# EAGLE design picjtag (EAGLE 6.1)
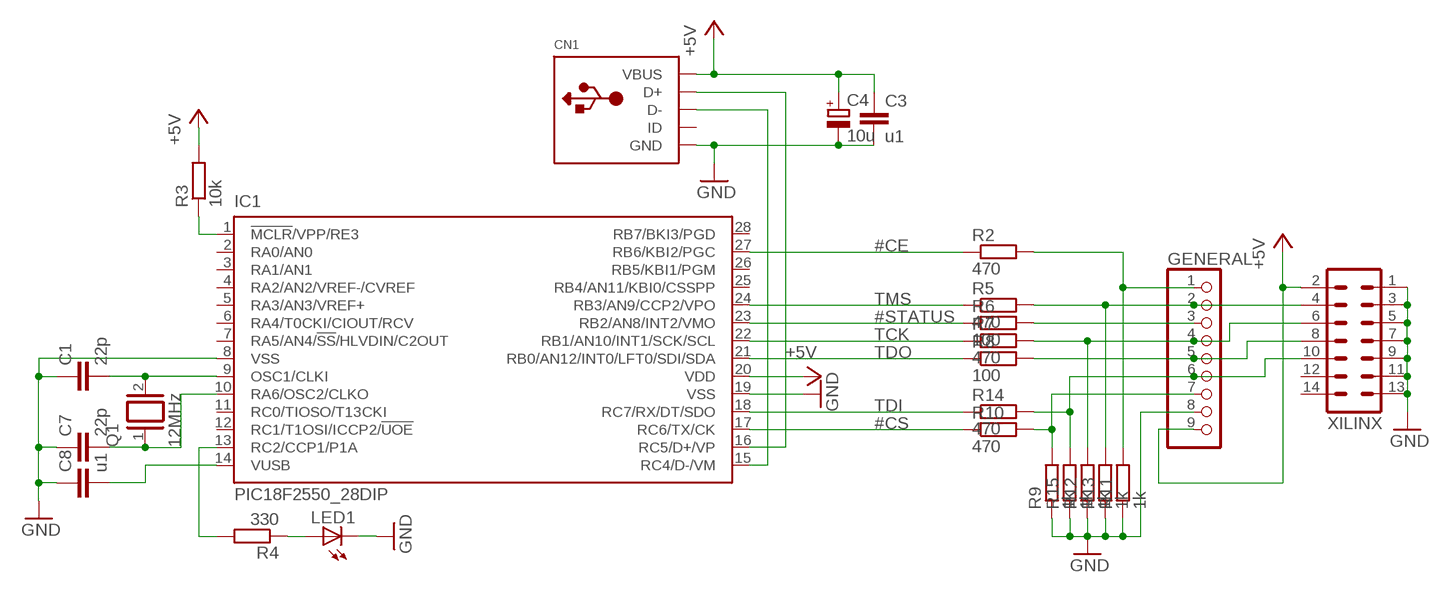
[diagram p0: schematic, sheet 1]

## Parts
C1  22p  C-EU025-025X050  [C025-025X050]
C3  u1  C-EU025-025X050  [C025-025X050]
C4  10u  CPOL-EUE2,5-6E  [E2,5-6E]
C7  22p  C-EU025-025X050  [C025-025X050]
C8  u1  C-EU025-025X050  [C025-025X050]
CN1  USBTHM  [USB-MINIB-THM]
GENERAL  PINHD-1X9  [1X09]
IC1  PIC18F2550_28DIP  [DIL28-3]
LED1  LED3MM  [LED3MM]
Q1  12MHz  XTAL/S  [QS]
R2  470  R-EU_0207/2V  [0207/2V]
R3  10k  R-EU_0207/2V  [0207/2V]
R4  330  R-EU_0207/2V  [0207/2V]
R5  470  R-EU_0207/2V  [0207/2V]
R6  100  R-EU_0207/2V  [0207/2V]
R7  470  R-EU_0207/2V  [0207/2V]
R8  100  R-EU_0207/2V  [0207/2V]
R9  1k  R-EU_0207/2V  [0207/2V]
R10  470  R-EU_0207/2V  [0207/2V]
R11  1k  R-EU_0207/2V  [0207/2V]
R12  1k  R-EU_0207/2V  [0207/2V]
R13  1k  R-EU_0207/2V  [0207/2V]
R14  470  R-EU_0207/2V  [0207/2V]
R15  1k  R-EU_0207/2V  [0207/2V]
XILINX  ML14  [ML14]

## Nets
#CE: IC1.27(RB6/KBI2/PGC) R2.1
#CS: IC1.17(RC6/TX/CK) R10.1
#STATUS: IC1.23(RB2/AN8/INT2/VMO) R6.1
+5V: C3.1 C4.+ CN1.VBUS GENERAL.9 IC1.20(VDD) R3.2 XILINX.2
GND: C1.1 C3.2 C4.- C7.1 C8.1 CN1.GND GENERAL.8 IC1.8(VSS) IC1.19(VSS) LED1.K(C) R9.1 R11.1 R12.1 R13.1 R15.1 XILINX.1 XILINX.3 XILINX.5 XILINX.7 XILINX.9 XILINX.11 XILINX.13
N$1: C7.2 IC1.10(RA6/OSC2/CLKO) Q1.1
N$2: IC1.1(!MCLR!/VPP/RE3) R3.1
N$3: CN1.D- IC1.15(RC4/D-/VM)
N$4: CN1.D+ IC1.16(RC5/D+/VP)
N$5: IC1.13(RC2/CCP1/P1A) R4.2
N$6: LED1.A R4.1
N$7: C1.2 IC1.9(OSC1/CLKI) Q1.2
N$8: C8.2 IC1.14(VUSB)
N$9: GENERAL.7 R9.2 R10.2
N$10: GENERAL.6 R14.2 R15.2 XILINX.10
N$11: GENERAL.4 R7.2 R12.2 XILINX.6
N$12: GENERAL.2 R5.2 R13.2 XILINX.4
N$13: GENERAL.1 R2.2 R11.2
N$14: GENERAL.5 R8.2 XILINX.8
N$15: GENERAL.3 R6.2
TCK: IC1.22(RB1/AN10/INT1/SCK/SCL) R7.1
TDI: IC1.18(RC7/RX/DT/SDO) R14.1
TDO: IC1.21(RB0/AN12/INT0/LFT0/SDI/SDA) R8.1
TMS: IC1.24(RB3/AN9/CCP2/VPO) R5.1
Unconnected: CN1.ID IC1.2(RA0/AN0) IC1.3(RA1/AN1) IC1.4(RA2/AN2/VREF-/CVREF) IC1.5(RA3/AN3/VREF+) IC1.6(RA4/T0CKI/CIOUT/RCV) IC1.7(RA5/AN4/!SS!/HLVDIN/C2OUT) IC1.11(RC0/TIOSO/T13CKI) IC1.12(RC1/T1OSI/ICCP2/!UOE) IC1.25(RB4/AN11/KBI0/CSSPP) IC1.26(RB5/KBI1/PGM) IC1.28(RB7/BKI3/PGD) XILINX.12 XILINX.14

## Library data of the parts
C1 C3 C7 C8 = rcl:C-EU: CAPACITOR, European symbol
C4 = rcl:CPOL-EU: POLARIZED CAPACITOR, European symbol
CN1 = adafruit:USB: USB Connectors USBMINIB - Surface Mount Female Mini-B USB Connector 4UConnector: 06564 By microbuilder.eu Thru-hole RA Female Mini-B USB Connector 4UConnector: 18732 By ladyada.net
GENERAL = pinhead:PINHD-1X9: PIN HEADER
IC1 = microchip:PIC18F2*_28: USB Microcontrollers with nanoWatt Technology High-Performance, Enhanced Flash, 28/40/44-Pin, Source: http://ww1.microchip.com/downloads/en/devicedoc/39632c.pdf; MF: MICROCHIP; MPN: PIC18F2550-I/SP; OC_FARNELL: 1523822; OC_NEWARK: 80K6054
LED1 = led:LED: LED OSRAM: - CHIPLED LG R971, LG N971, LY N971, LG Q971, LY Q971, LO R971, LY R971 LH N974, LH R974 LS Q976, LO Q976, LY Q976 LO Q996 - Hyper CHIPLED LW Q18S LB Q993, LB Q99A, LB R99A - SideLED LS A670, LO A670, LY A670, LG A670, LP A670 LB A673, LV A673, LT A673, LW A673 LH A674 LY A675 LS A676, LA A676, LO A676, LY A676, LW A676 LS A679, LY A679, LG A679 - Hyper Micro SIDELED® LS Y876, LA Y876, LO Y876, LY Y876 LT Y87S - SmartLED LW L88C, LW L88S LB L89C, LB L89S, LG L890 LS L89K, LO L89K, LY L89K LS L896, LA L896, LO L896, LY L896 - TOPLED LS T670, LO T670, LY T670, LG T670, LP T670 LSG T670, LSP T670, LSY T670, LOP T670, LYG T670 LG T671, LOG T671, LSG T671 LB T673, LV T673, LT T673, LW T673 LH T674 LS T676, LA T676, LO T676, LY T676, LB T676, LH T676, LSB T676, LW T676 LB T67C, LV T67C, LT T67C, LS T67K, LO T67K, LY T67K, LW E67C LS E67B, LA E67B, LO E67B, LY E67B, LB E67C, LV E67C, LT E67C LW T67C LS T679, LY T679, LG T679 LS T770, LO T770, LY T770, LG T770, LP T770 LB T773, LV T773, LT T773, LW T773 LH T774 LS E675, LA E675, LY E675, LS T675 LS T776, LA T776, LO T776, LY T776, LB T776 LHGB T686 LT T68C, LB T68C - Hyper Mini TOPLED® LB M676 - Mini TOPLED Santana® LG M470 LS M47K, LO M47K, LY M47K Source: http://www.osram.convergy.de LUXEON: - LUMILED® LXK2-PW12-R00, LXK2-PW12-S00, LXK2-PW14-U00, LXK2-PW14-V00 LXK2-PM12-R00, LXK2-PM12-S00, LXK2-PM14-U00 LXK2-PE12-Q00, LXK2-PE12-R00, LXK2-PE12-S00, LXK2-PE14-T00, LXK2-PE14-U00 LXK2-PB12-K00, LXK2-PB12-L00, LXK2-PB12-M00, LXK2-PB14-N00, LXK2-PB14-P00, LXK2-PB14-Q00 LXK2-PR12-L00, LXK2-PR12-M00, LXK2-PR14-Q00, LXK2-PR14-R00 LXK2-PD12-Q00, LXK2-PD12-R00, LXK2-PD12-S00 LXK2-PH12-R00, LXK2-PH12-S00 LXK2-PL12-P00, LXK2-PL12-Q00, LXK2-PL12-R00 Source: www.luxeon.com KINGBRIGHT: KA-3528ASYC Source: www.kingbright.com
Q1 = special:XTAL/S: CRYSTAL
R2-R15 = rcl:R-EU_: RESISTOR, European symbol
XILINX = con-harting-ml:ML14: HARTING; OC_FARNELL: unknown; OC_NEWARK: unknown

## Board
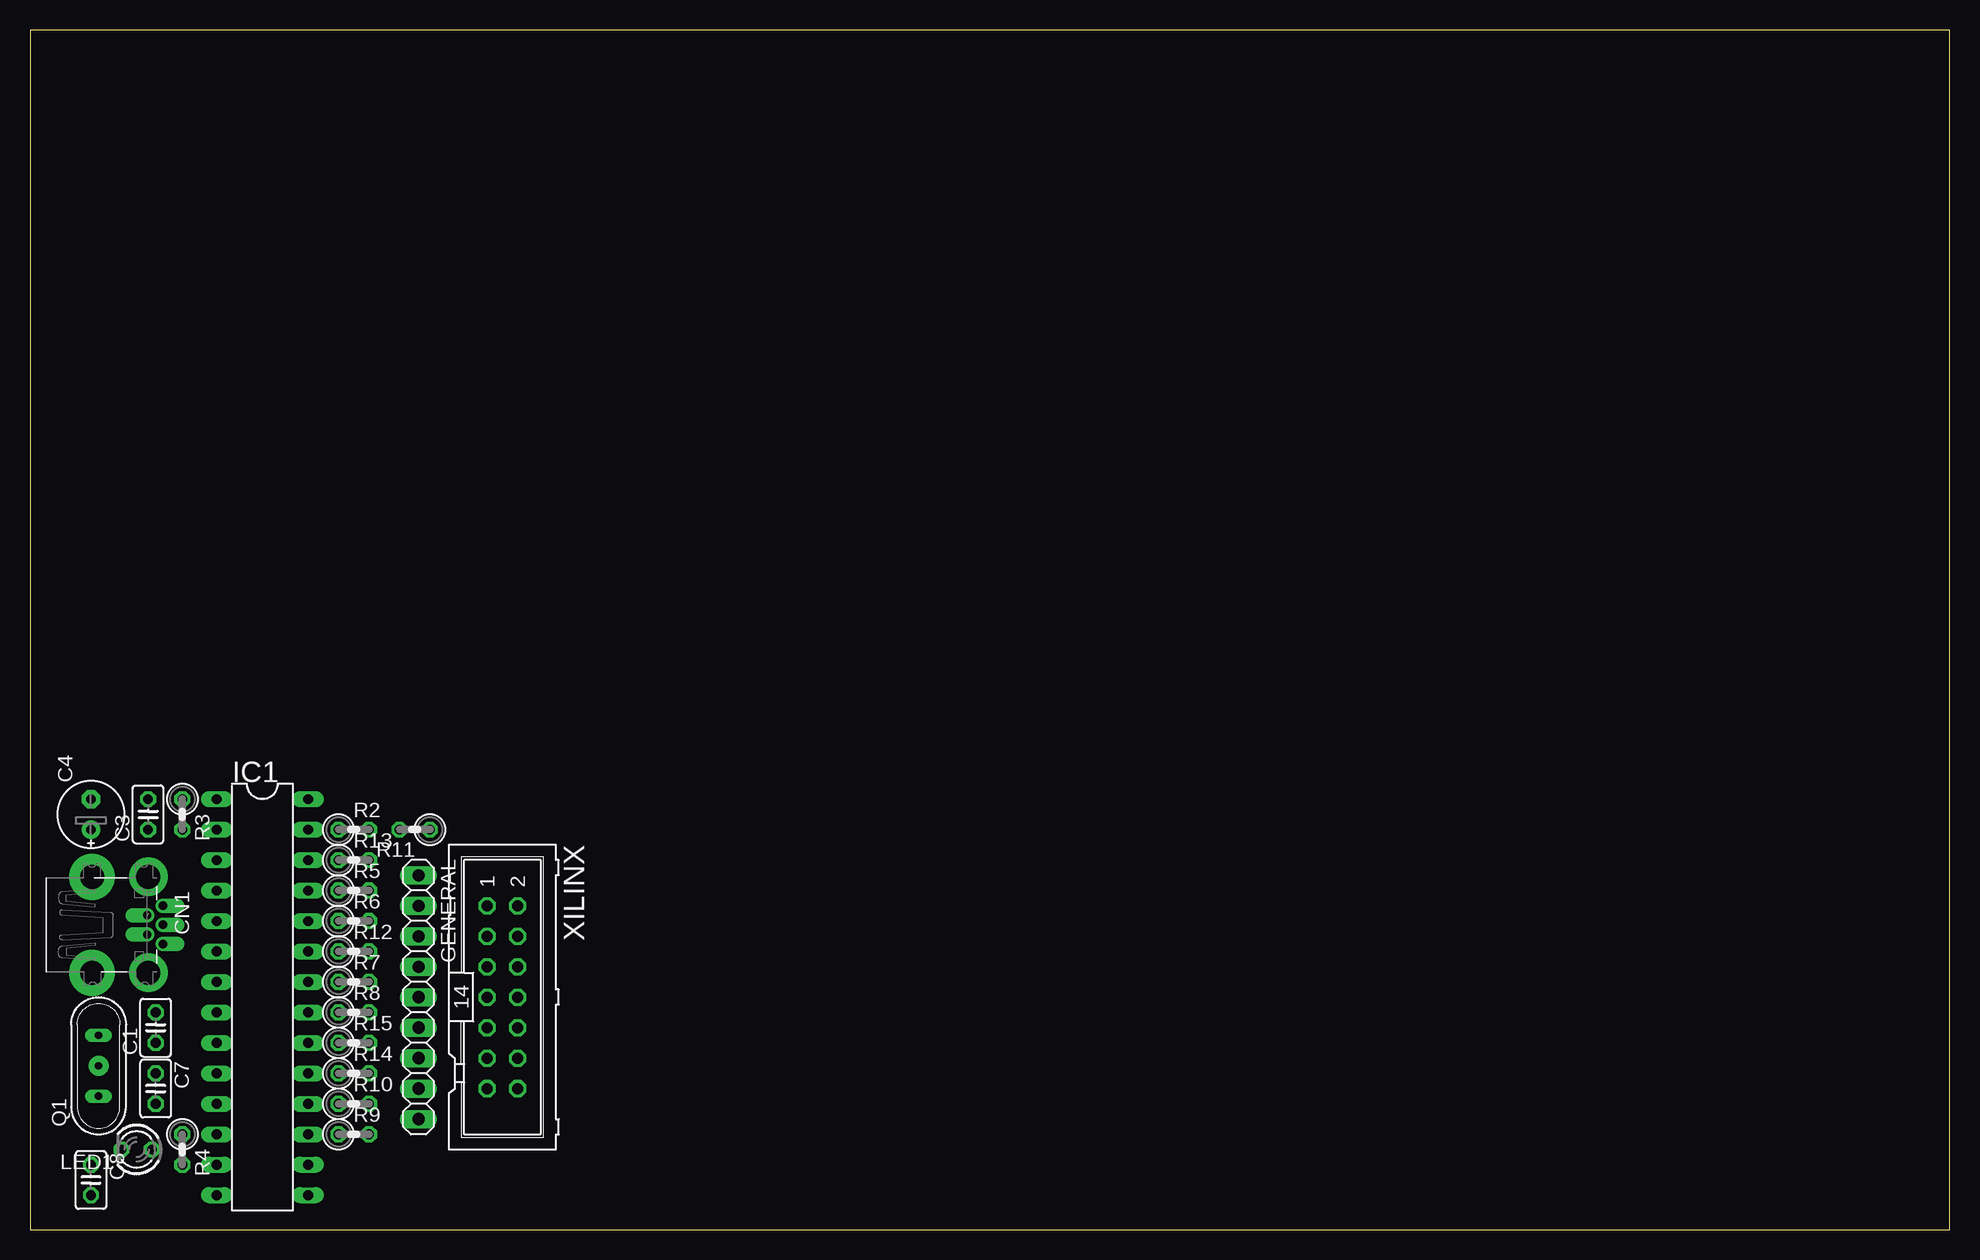
[diagram p1: board, top side]
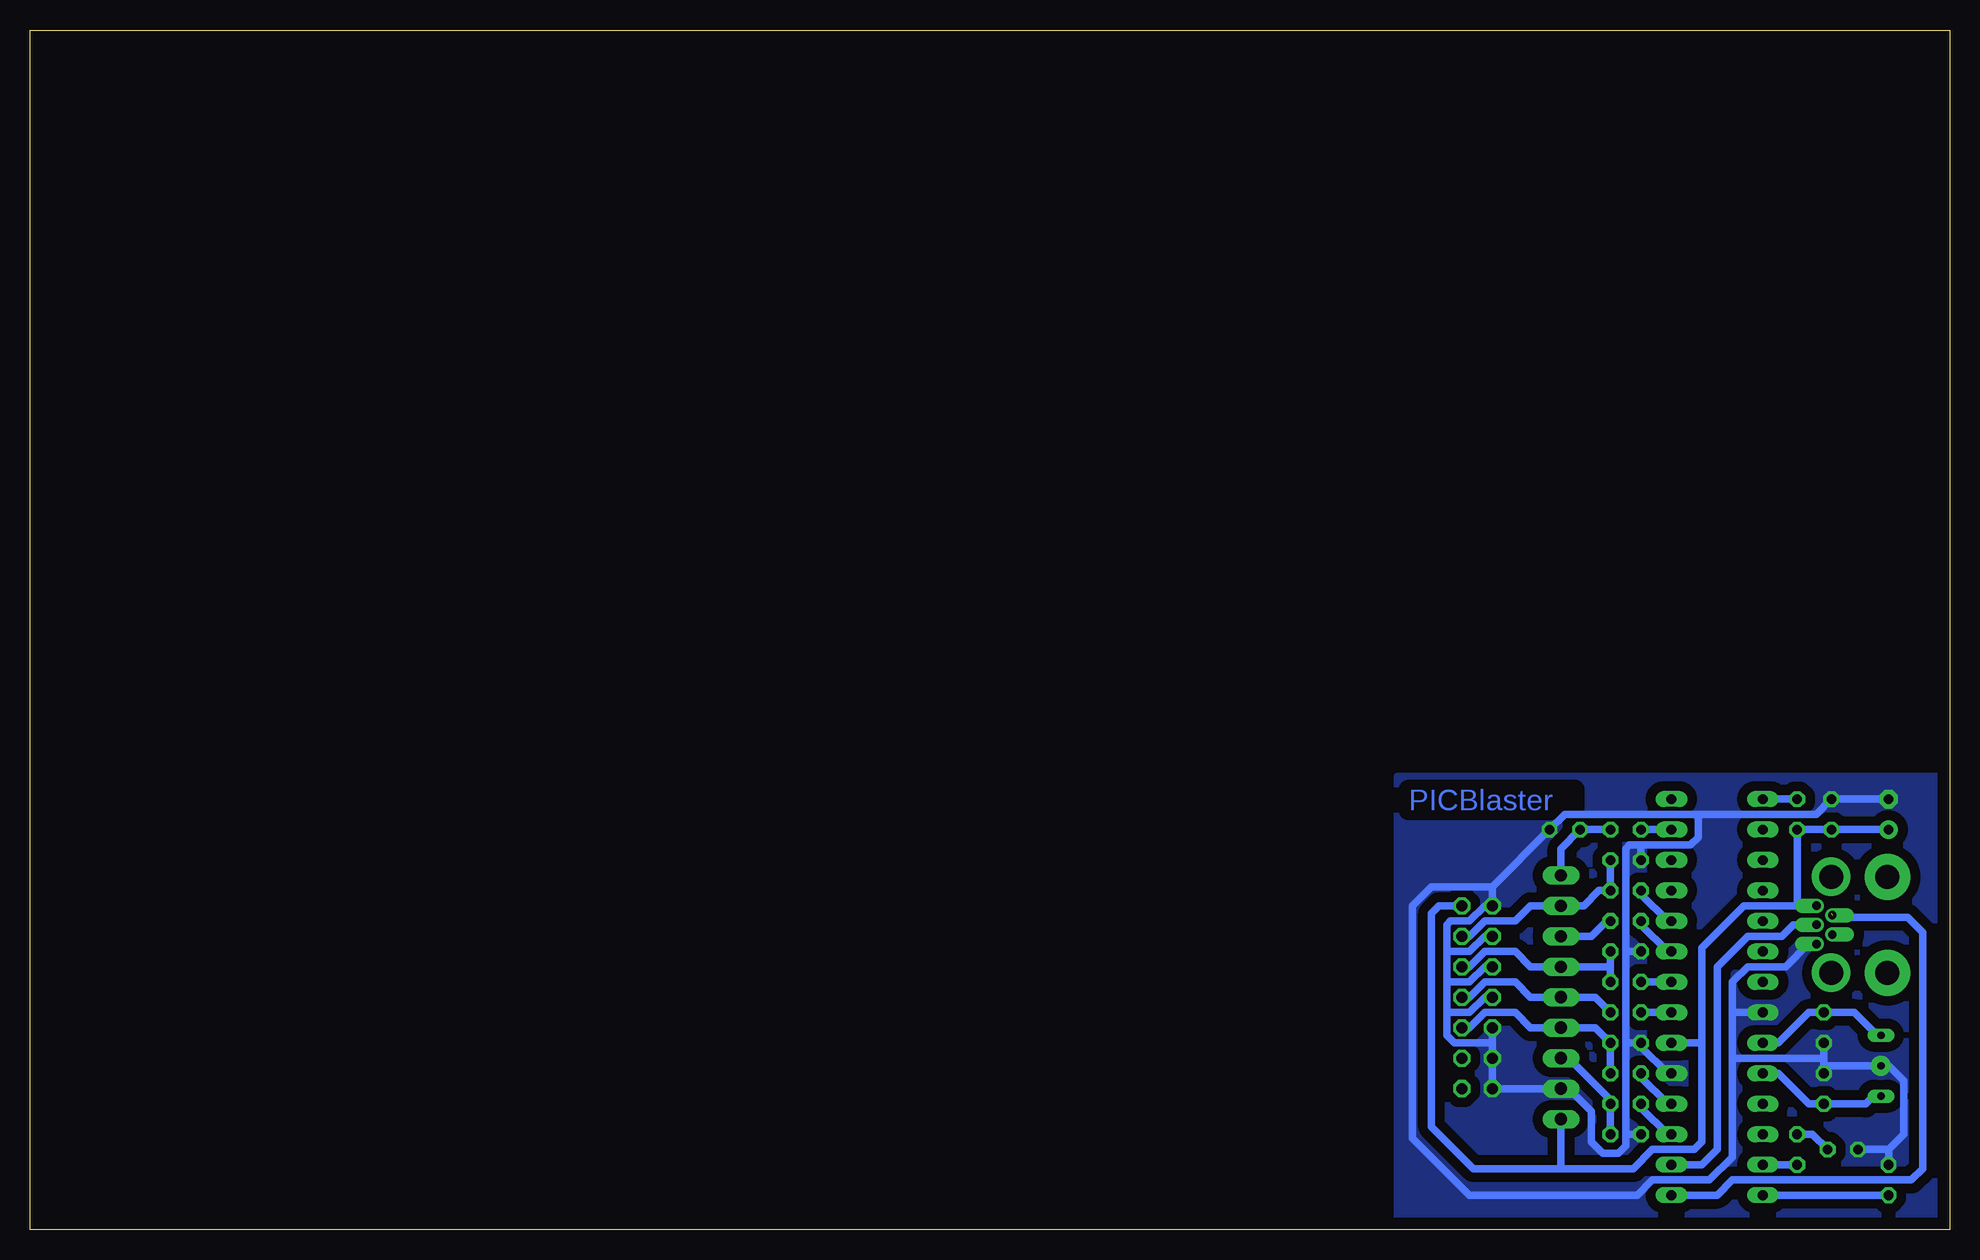
[diagram p2: board, bottom side, seen from below]

Size 160 x 100 mm. Coordinates in mm from the lower left corner, seen from the top.
Outline: 0,0 160,0 160,100 0,100 0,0
Copper layers (1*16): Top 0.035mm / dielectric 1.5mm / Bottom 0.035mm
Design rules: minimum track width 10mil, minimum drill 24mil, track to track 8mil, track to pad 8mil, pad to pad 8mil, via to via 8mil, smd to smd 8mil, copper to edge 40mil, drill to drill 8mil, minimum pad ring 10mil, minimum via ring 8mil, stop-mask expansion 4mil, vias tented up to drill 0mil, thermal gap 10mil

### Footprints (pad centres in the part's own frame; a part is rotated, then mirrored left to right if it is on the bottom)
C025-025X050 = drill 0.813 octagon: 1 -1.27,0; 2 1.27,0
E2,5-6E = drill 0.813 pad 1.575: + -1.27,0 | drill 0.813 pad 1.575 octagon: - 1.27,0
USB-MINIB-THM = drill 0.7 offset: D+ 0,9.8; D- -0.8,8.5; GND 1.6,9.8; ID 0.8,8.5; VBUS -1.6,9.8 | drill 2 pad 3.81: GND1 -4,3.9; GND4 4,3.9 | drill 2 pad 3.2: GND2 -4,8.6; GND3 4,8.6
1X09 = drill 1.016 long: 1 -10.16,0; 2 -7.62,0; 3 -5.08,0; 4 -2.54,0; 5 0,0; 6 2.54,0; 7 5.08,0; 8 7.62,0; 9 10.16,0
DIL28-3 = drill 0.813 long: 1 -16.51,-3.81; 2 -13.97,-3.81; 3 -11.43,-3.81; 4 -8.89,-3.81; 5 -6.35,-3.81; 6 -3.81,-3.81; 7 -1.27,-3.81; 8 1.27,-3.81; 9 3.81,-3.81; 10 6.35,-3.81; 11 8.89,-3.81; 12 11.43,-3.81; 13 13.97,-3.81; 14 16.51,-3.81; 15 16.51,3.81; 16 13.97,3.81; 17 11.43,3.81; 18 8.89,3.81; 19 6.35,3.81; 20 3.81,3.81; 21 1.27,3.81; 22 -1.27,3.81; 23 -3.81,3.81; 24 -6.35,3.81; 25 -8.89,3.81; 26 -11.43,3.81; 27 -13.97,3.81; 28 -16.51,3.81
LED3MM = drill 0.813 octagon: A -1.27,0; K 1.27,0
QS = drill 0.61 long: 1 -2.54,0; 2 2.54,0
0207/2V = drill 0.813 octagon: 1 -1.27,0; 2 1.27,0
ML14 = drill 0.914 octagon: 1 -7.62,-1.27; 2 -7.62,1.27; 3 -5.08,-1.27; 4 -5.08,1.27; 5 -2.54,-1.27; 6 -2.54,1.27; 7 0,-1.27; 8 0,1.27; 9 2.54,-1.27; 10 2.54,1.27; 11 5.08,-1.27; 12 5.08,1.27; 13 7.62,-1.27; 14 7.62,1.27

### Placement (x,y rotation side)
C1  10.48,16.83 90 top
C3  9.84,34.61 90 top
C4  5.08,34.61 90 top
C7  10.48,11.75 270 top
C8  5.08,4.13 270 top
CN1  1.27,25.4 270 top
GENERAL  32.38,19.37 270 top
IC1  19.37,19.37 270 top
LED1  8.89,6.67 180 top
Q1  5.71,13.65 90 top
R2  26.99,33.34 0 top
R3  12.7,34.61 270 top
R4  12.7,6.67 270 top
R5  26.99,28.26 0 top
R6  26.99,25.72 0 top
R7  26.99,20.64 0 top
R8  26.99,18.1 0 top
R9  26.99,7.94 0 top
R10  26.99,10.48 0 top
R11  32.07,33.34 180 top
R12  26.99,23.18 0 top
R13  26.99,30.8 0 top
R14  26.99,13.02 0 top
R15  26.99,15.56 0 top
XILINX  39.37,19.37 270 top

### Tracks (layer width: path | path; a pad name or v marks a point on that pad's centre or on a via)
#CE
  Bottom 0.61: IC1.27 R2.1
#CS
  Bottom 0.61: IC1.17 23.5,7.94 25.72,10.16 R10.1
#STATUS
  Bottom 0.61: IC1.23 23.5,23.18 25.72,25.4 R6.1
+5V
  Bottom 0.61: 12.7,27 CN1.VBUS 12.37,27 12.38,26.99 | 12.7,27 17.13,27 20.64,23.5 20.64,15.56 | 20.64,15.56 20.64,7.3 21.27,6.67 24.77,6.67 26.35,5.08 32.38,5.08 | IC1.20 20.64,15.56 | C4.+ C3.1 R3.2 12.7,27 | 32.38,5.08 39.69,5.08 43.18,8.57 43.18,26.35 42.55,26.99 XILINX.2 | GENERAL.9 32.38,5.08
GND  (via drill 0.6 pad 1.68)
  Bottom 0.61: 26.99,15.56 R15.1 25.72,15.24 23.5,13.02 IC1.19 | 26.99,23.18 R12.1 | 26.99,15.56 26.99,23.18 | C8.1 5.08,6.67 | CN1.GND 11.76,23.8 13.65,21.91 16.83,21.91 18.1,20.64 18.1,18.1 | C4.- C3.2 11.11,34.61 20.95,34.61 | 26.99,15.56 26.99,7.94 | 26.99,7.94 R9.1 | 26.99,7.94 26.99,6.99 27.62,6.35 28.89,6.35 29.84,7.3 29.84,9.84 31.75,11.75 GENERAL.8 XILINX.13 XILINX.11 38.1,15.56 | 18.1,18.1 18.1,14.29 | 18.1,14.29 18.1,6.03 20,4.13 24.77,4.13 26.04,2.86 40.01,2.86 44.77,7.62 44.77,26.99 43.18,28.57 38.1,28.57 | 10.48,14.29 10.48,13.65 | 10.48,13.65 C7.1 | C1.1 10.48,14.29 | 10.48,14.29 18.1,14.29 | LED1.K 5.08,6.67 | 5.08,6.67 3.81,7.94 3.81,12.38 5.08,13.65 v5.71,13.65 10.48,13.65 | 25.72,32.07 26.67,32.07 26.99,31.75 26.99,23.18 | 25.72,32.07 21.59,32.07 20.95,32.7 20.95,34.61 | R13.1 25.72,32.07 | 41.91,23.18 40.01,23.18 38.73,24.45 XILINX.3 | 41.91,23.18 41.91,25.4 41.59,25.72 40.01,25.72 38.73,26.99 XILINX.1 38.1,28.57 | 41.91,23.18 41.91,20.64 | XILINX.5 38.73,21.91 40.01,20.64 41.91,20.64 | 41.91,20.64 41.91,18.1 | XILINX.7 38.73,19.37 40.01,18.1 41.91,18.1 | 41.91,18.1 41.91,16.19 41.27,15.56 38.1,15.56 | XILINX.9 38.1,15.56 | 20.95,34.61 32.07,34.61 R11.1 38.1,28.57 | IC1.8 18.1,18.1
  pour Bottom (isolate 0.813, no thermals): 0.95,0.95 46.04,0.95 46.04,37.78 0.95,37.78
N$1
  Bottom 0.61: Q1.1 6.35,11.11 6.99,10.48 C7.2 11.75,10.48 14.29,13.02 IC1.10
N$2
  Bottom 0.61: R3.1 IC1.1
N$3  (1 unrouted)
  Bottom 0.61: IC1.15 19.37,2.86 18.1,4.13 3.17,4.13 2.22,5.08 2.22,24.77 3.49,26.04 9.84,26.04 9.84,26.35
N$4
  Bottom 0.61: IC1.16 20.64,5.4 19.37,6.67 19.37,21.91 16.83,24.45 13.97,24.45 13.02,25.4 CN1.D+
N$5
  Bottom 0.61: R4.2 IC1.13
N$6
  Bottom 0.61: LED1.A 11.43,7.94 R4.1
N$7
  Bottom 0.61: Q1.2 6.03,16.19 7.94,18.1 C1.2 | 10.79,18.1 C1.2 | C1.2 11.75,18.1 14.29,15.56 IC1.9
N$8
  Bottom 0.61: C8.2 IC1.14
N$9
  Bottom 0.61: R9.2 R10.2 28.26,10.79 31.75,14.29 GENERAL.7
N$10
  Bottom 0.61: R14.2 R15.2 29.53,16.83 GENERAL.6 34.92,16.83 36.2,18.1 38.73,18.1 40.01,16.83 XILINX.10
N$11
  Bottom 0.61: 28.26,21.91 GENERAL.4 34.92,21.91 36.2,23.18 38.73,23.18 40.01,21.91 XILINX.6 | 28.26,21.91 R7.2 | 28.26,21.91 R12.2
N$12
  Bottom 0.61: R13.2 R5.2 29.21,28.26 30.48,26.99 GENERAL.2 34.92,26.99 36.2,25.72 38.73,25.72 40.01,24.45 XILINX.4
N$13
  Bottom 0.61: R2.2 R11.2 32.38,31.75 GENERAL.1
N$14
  Bottom 0.61: XILINX.8 40.01,19.37 38.73,20.64 36.2,20.64 34.92,19.37 GENERAL.5 29.53,19.37 R8.2
N$15
  Bottom 0.61: R6.2 28.57,25.72 29.84,24.45 GENERAL.3
TCK
  Bottom 0.61: IC1.22 R7.1
TDI
  Bottom 0.61: IC1.18 23.5,10.48 25.72,12.7 R14.1
TDO
  Bottom 0.61: IC1.21 R8.1
TMS
  Bottom 0.61: IC1.24 23.5,25.72 25.72,27.94 R5.1

### Text on the board
Bottom: PICBlaster